# Altium schematic sheet PWM Filter.SchDoc
size A4
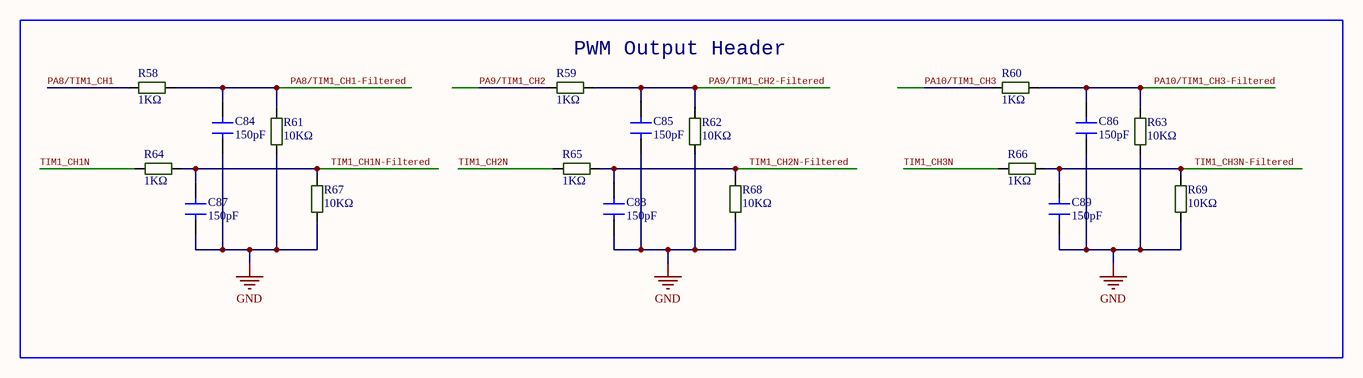
[diagram p0: PWM Filter.SchDoc]

## Parts
C84  150pF  [C-0603W]
C85  150pF  [C-0603W]
C86  150pF  [C-0603W]
C87  150pF  [C-0603W]
C88  150pF  [C-0603W]
C89  150pF  [C-0603W]
R58  1KΩ  [R-0805]
R59  1KΩ  [R-0805]
R60  1KΩ  [R-0805]
R61  10KΩ  [R-0805]
R62  10KΩ  [R-0805]
R63  10KΩ  [R-0805]
R64  1KΩ  [R-0805]
R65  1KΩ  [R-0805]
R66  1KΩ  [R-0805]
R67  10KΩ  [R-0805]
R68  10KΩ  [R-0805]
R69  10KΩ  [R-0805]

## Blocks framed on the sheet
PWM Output Header: C84-C89 R58-R69

## Nets
GND: C84.1 C85.1 C86.1 C87.1 C88.1 C89.1 R61.1 R62.1 R63.1 R67.1 R68.1 R69.1
PA8/TIM1_CH1: R58.1
PA8/TIM1_CH1-Filtered: C84.2 R58.2 R61.2
PA9/TIM1_CH2: R59.1
PA9/TIM1_CH2-Filtered: C85.2 R59.2 R62.2
PA10/TIM1_CH3: R60.1
PA10/TIM1_CH3-Filtered: C86.2 R60.2 R63.2
TIM1_CH1N: R64.1
TIM1_CH1N-Filtered: C87.2 R64.2 R67.2
TIM1_CH2N: R65.1
TIM1_CH2N-Filtered: C88.2 R65.2 R68.2
TIM1_CH3N: R66.1
TIM1_CH3N-Filtered: C89.2 R66.2 R69.2

## Library data of the parts
C84-C89 = C-0603
R58-R69 = R-0805